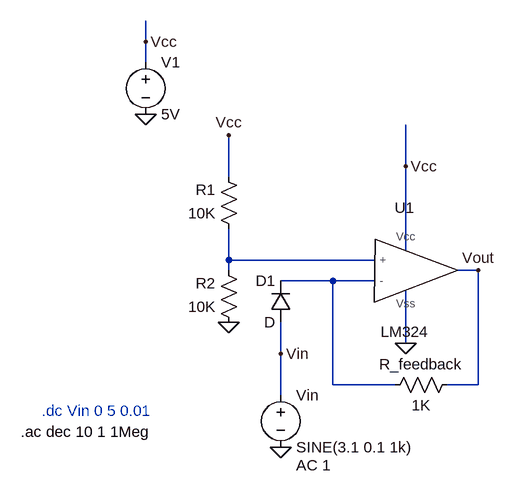
[diagram p0: schematic BAI 6 THUC HANH 4.asc]
BAI 6 THUC HANH 4.asc, the LTspice schematic file:
Version 4.1
SHEET 1 880 680
WIRE -256 -192 -256 -224
WIRE -256 -160 -256 -192
WIRE 144 0 144 -64
WIRE -128 16 -128 -48
WIRE 144 128 144 0
WIRE -128 144 -128 96
WIRE 96 144 -128 144
WIRE -128 160 -128 144
WIRE 256 160 224 160
WIRE 32 176 -48 176
WIRE 96 176 32 176
WIRE 144 272 144 192
WIRE -48 288 -48 240
WIRE 32 336 32 176
WIRE 128 336 32 336
WIRE 256 336 256 160
WIRE 256 336 208 336
WIRE -48 352 -48 288
FLAG -256 -192 Vcc
FLAG -256 -80 0
FLAG 144 0 Vcc
FLAG -128 -48 Vcc
FLAG -128 240 0
FLAG -48 288 Vin
FLAG -48 432 0
FLAG 256 160 Vout
FLAG 144 272 0
SYMBOL LM324 144 160 R0
SYMATTR InstName U1
SYMBOL voltage -256 -176 R0
SYMATTR InstName V1
SYMATTR Value 5V
SYMBOL res -112 112 R180
WINDOW 0 36 76 Left 2
WINDOW 3 36 40 Left 2
SYMATTR InstName R1
SYMATTR Value 10K
SYMBOL res -112 256 R180
WINDOW 0 36 76 Left 2
WINDOW 3 36 40 Left 2
SYMATTR InstName R2
SYMATTR Value 10K
SYMBOL voltage -48 336 R0
WINDOW 123 24 124 Left 2
WINDOW 39 0 0 Left 0
SYMATTR InstName Vin
SYMATTR Value SINE(3.1 0.1 1k)
SYMATTR Value2 AC 1
SYMBOL diode -32 240 R180
WINDOW 0 24 64 Left 2
WINDOW 3 24 0 Left 2
SYMATTR InstName D1
SYMBOL res 224 320 R90
WINDOW 0 0 56 VBottom 2
WINDOW 3 32 56 VTop 2
SYMATTR InstName R_feedback
SYMATTR Value 1K
TEXT -416 376 Left 2 ;.dc Vin 0 5 0.01
TEXT -448 408 Left 2 !.ac dec 10 1 1Meg

The netlist it stands for:
* BAI 6 THUC HANH 4.asc
X§U1 N001 N002 Vcc 0 Vout LM324  ; pins + - Vcc Vss ?
V1 Vcc 0 5V
R1 N001 Vcc 10K
R2 0 N001 10K
Vin Vin 0 SINE(3.1 0.1 1k) AC 1
D1 Vin N002 D
R_feedback Vout N002 1K
.model D D
.lib standard.dio
* .dc Vin 0 5 0.01
.ac dec 10 1 1Meg
.lib E:\ThiThucHanhCoHa\CoHa\LM324.cir
.backanno
.end